# EAGLE design imp2_rev1 (EAGLE 7.7.0)
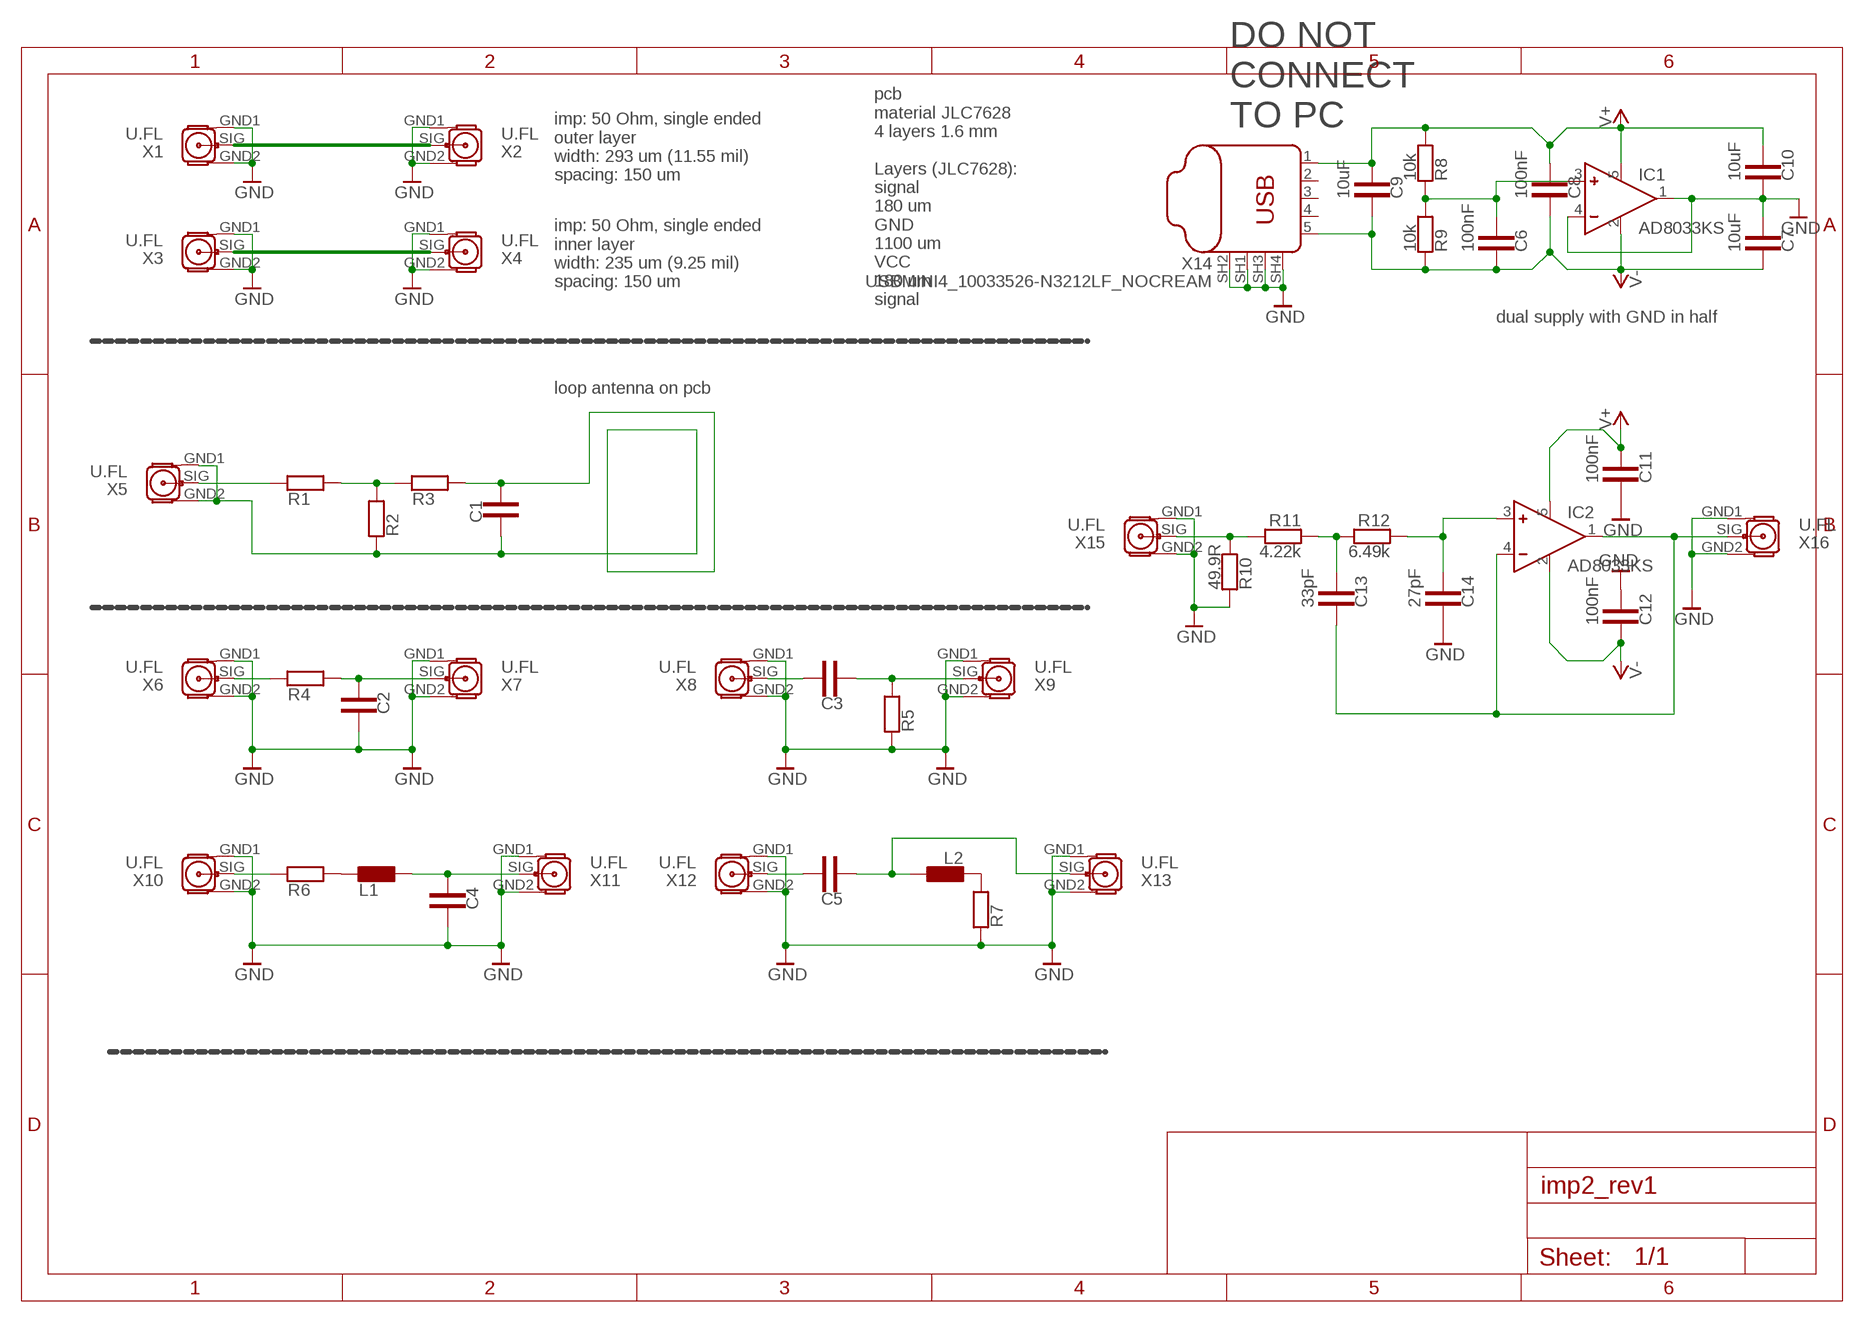
[diagram p0: schematic, sheet 1]

## Parts
C1  C0603  [0603MIL]
C2  C0603  [0603MIL]
C3  C0603  [0603MIL]
C4  C0603  [0603MIL]
C5  C0603  [0603MIL]
C6  100nF  C0603  [0603MIL]
C7  10uF  C0805  [0805MIL]
C8  100nF  C0603  [0603MIL]
C9  10uF  C0805  [0805MIL]
C10  10uF  C0805  [0805MIL]
C11  100nF  C0603  [0603MIL]
C12  100nF  C0603  [0603MIL]
C13  33pF  C0603  [0603MIL]
C14  27pF  C0603  [0603MIL]
IC1  AD8033KS  [SC-705]
IC2  AD8033KS  [SC-705]
L1  L0603  [0603MIL]
L2  L0603  [0603MIL]
R1  R0603  [0603MIL]
R2  R0603  [0603MIL]
R3  R0603  [0603MIL]
R4  R0603  [0603MIL]
R5  R0603  [0603MIL]
R6  R0603  [0603MIL]
R7  R0603  [0603MIL]
R8  10k  R0603  [0603MIL]
R9  10k  R0603  [0603MIL]
R10  49.9R  R0603  [0603MIL]
R11  4.22k  R0603  [0603MIL]
R12  6.49k  R0603  [0603MIL]
X1  U.FL  [U.FL_CONUFL001-SMD]
X2  U.FL  [U.FL_CONUFL001-SMD]
X3  U.FL  [U.FL_CONUFL001-SMD]
X4  U.FL  [U.FL_CONUFL001-SMD]
X5  U.FL  [U.FL_CONUFL001-SMD]
X6  U.FL  [U.FL_CONUFL001-SMD]
X7  U.FL  [U.FL_CONUFL001-SMD]
X8  U.FL  [U.FL_CONUFL001-SMD]
X9  U.FL  [U.FL_CONUFL001-SMD]
X10  U.FL  [U.FL_CONUFL001-SMD]
X11  U.FL  [U.FL_CONUFL001-SMD]
X12  U.FL  [U.FL_CONUFL001-SMD]
X13  U.FL  [U.FL_CONUFL001-SMD]
X14  USBMINI4_10033526-N3212LF_NOCREAM  [USB-MINI_SMD_10033526_NOCREAM]
X15  U.FL  [U.FL_CONUFL001-SMD]
X16  U.FL  [U.FL_CONUFL001-SMD]

## Nets
GND: C2.1 C4.1 C7.2 C10.1 C11.1 C12.2 C14.1 IC1.1(OUT) IC1.4(IN-) R5.1 R7.1 R10.1 X1.GND1 X1.GND2 X2.GND1 X2.GND2 X3.GND1 X3.GND2 X4.GND1 X4.GND2 X6.GND1 X6.GND2 X7.GND1 X7.GND2 X8.GND1 X8.GND2 X9.GND1 X9.GND2 X10.GND1 X10.GND2 X11.GND1 X11.GND2 X12.GND1 X12.GND2 X13.GND1 X13.GND2 X14.SH1(G1) X14.SH2(G2) X14.SH3(G3) X14.SH4(G4) X15.GND1 X15.GND2 X16.GND1 X16.GND2
N$1: R1.1 X5.SIG
N$2: R1.2 R2.2 R3.1
N$3: R4.1 X6.SIG
N$4: C2.2 R4.2 X7.SIG
N$5: C3.1 X8.SIG
N$6: C3.2 R5.2 X9.SIG
N$7: R6.1 X10.SIG
N$8: C4.2 L1.2 X11.SIG
N$9: C5.1 X12.SIG
N$10: L1.1 R6.2
N$11: L2.1 R7.2
N$12: C5.2 L2.2 X13.SIG
N$13: C6.2 IC1.3(IN+) R8.1 R9.2
N$14: C1.1 C1.2 R2.1 R3.2 X5.GND1 X5.GND2
N$15: R10.2 R11.2 X15.SIG
N$16: C13.2 R11.1 R12.2
N$21: C14.2 IC2.3(IN+) R12.1
N$22: C13.1 IC2.1(OUT) IC2.4(IN-) X16.SIG
V+: C8.2 C9.2 C10.2 C11.2 IC1.5(VDD) IC2.5(VDD) R8.2 X14.1(VBUS)
V-: C6.1 C7.1 C8.1 C9.1 C12.1 IC1.2(VSS) IC2.2(VSS) R9.1 X14.5(GND)
W_0.235MM_LAY2: X3.SIG X4.SIG
W_0.293MM_TOP: X1.SIG X2.SIG
Unconnected: X14.2(D-) X14.3(D+) X14.4(ID)

## Notes on the sheet
- DO NOT 
  CONNECT 
  TO PC
- imp: 50 Ohm, single ended
  outer layer
  width: 293 um (11.55 mil)
  spacing: 150 um
- imp: 50 Ohm, single ended
  inner layer
  width: 235 um (9.25 mil)
  spacing: 150 um
- pcb 
  material JLC7628
  4 layers 1.6 mm
  
  Layers (JLC7628):
  signal
  180 um
  GND
  1100 um
  VCC
  180 um
  signal
- dual supply with GND in half
- loop antenna on pcb

## Library data of the parts
C1-C14 = general:C: C Kondensator im Chip-Gehäuse
IC1 IC2 = general:AD8033
L1 L2 = general:L: L Spule im Chip-Gehäuse
R1-R12 = general:R: R Widerstand im Chip-Gehäuse
X1-X13 X15 X16 = general:U.FL
X14 = general:USBMINI4

## Board
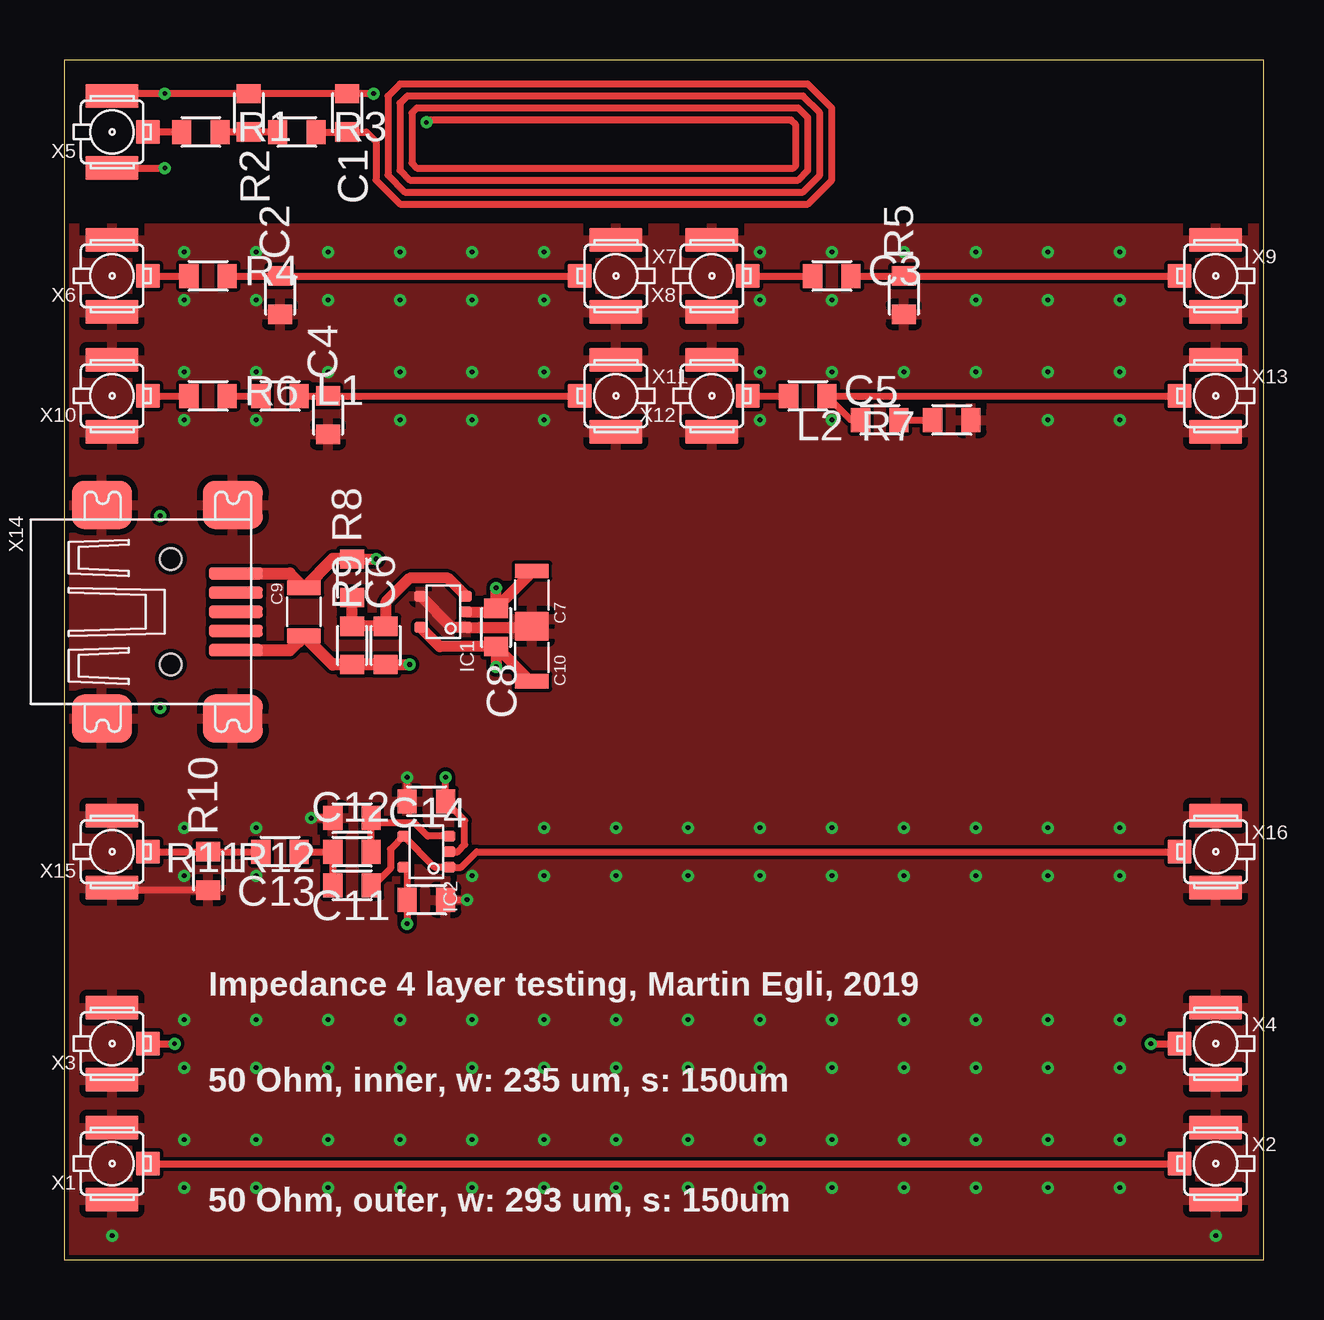
[diagram p1: board, top side]
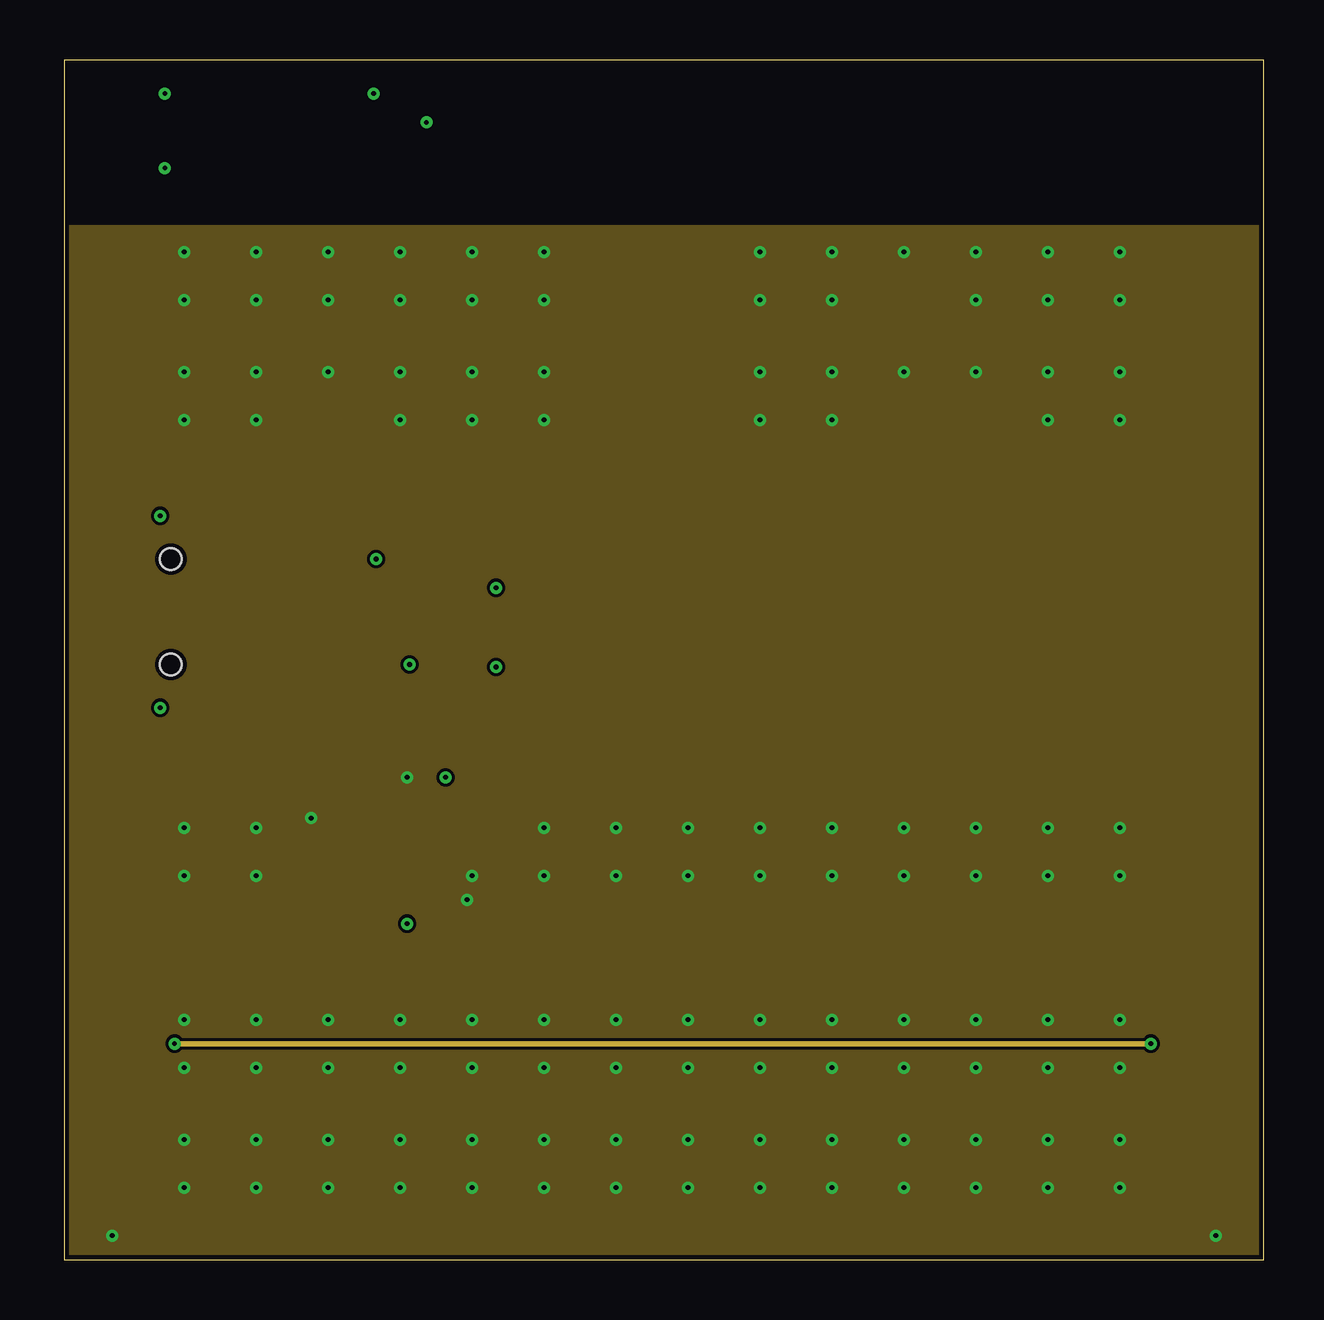
[diagram p2: board, inner layer Route2]
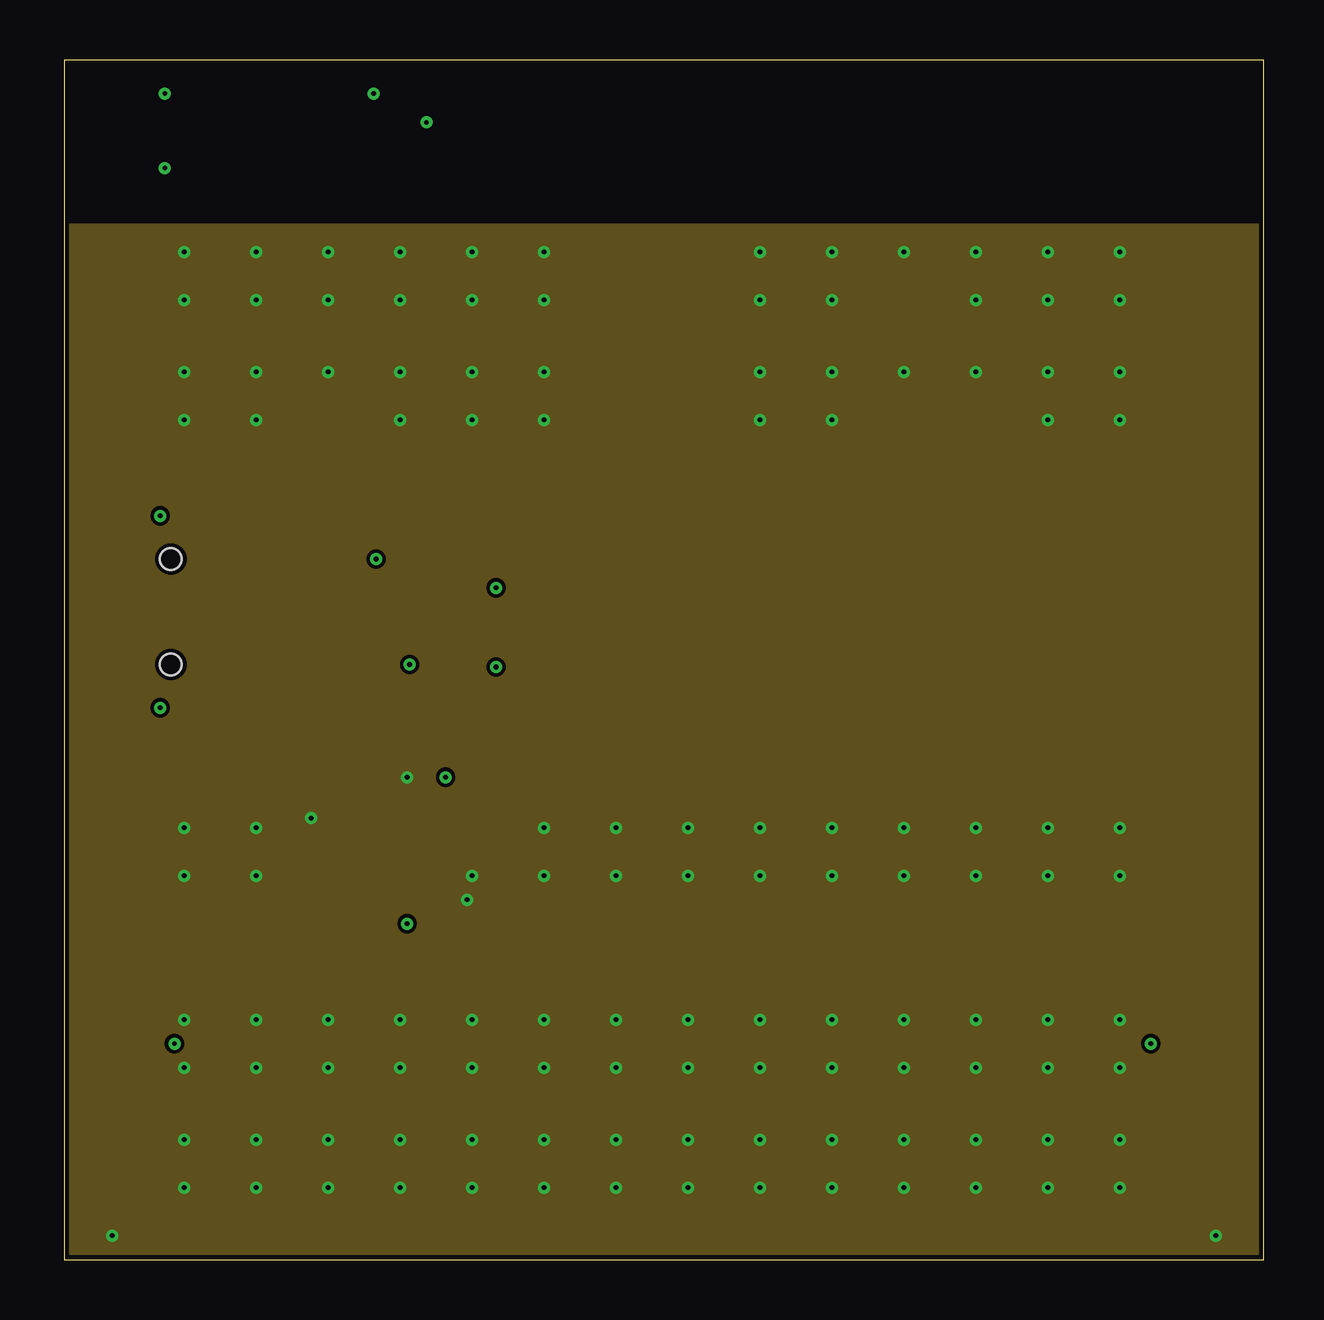
[diagram p3: board, inner layer Route15]
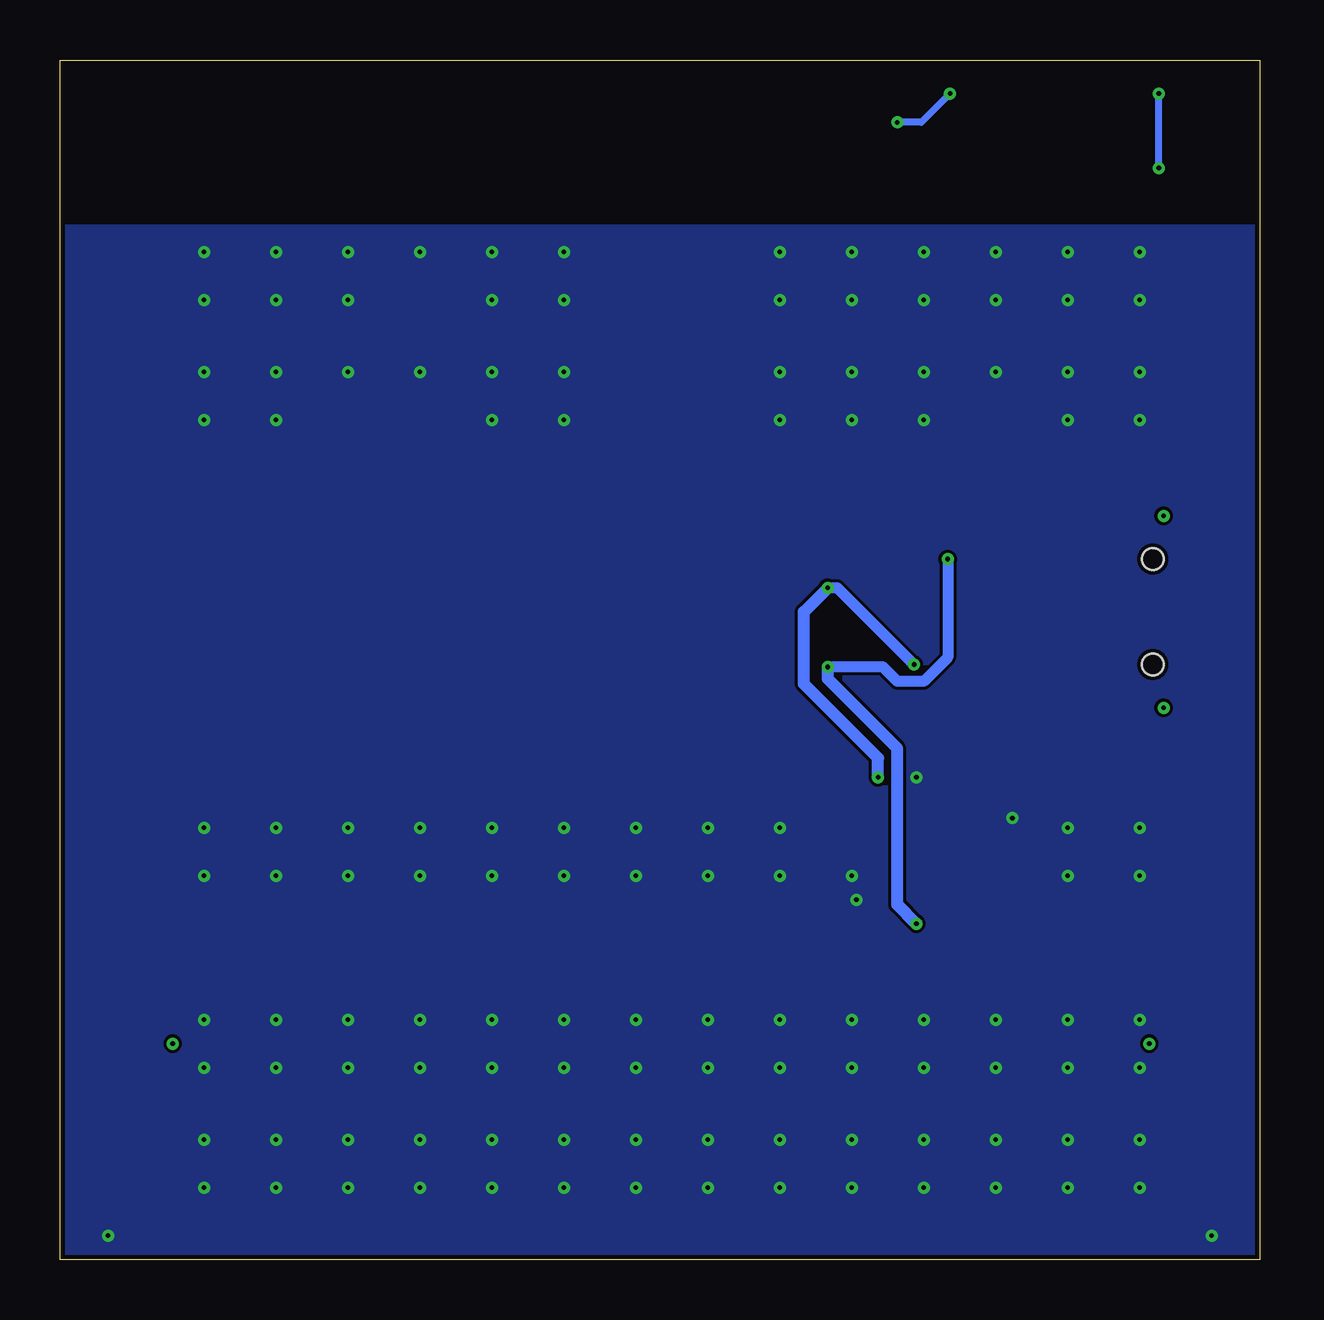
[diagram p4: board, bottom side, seen from below]

Size 50 x 50 mm. Coordinates in mm from the lower left corner, seen from the top.
Outline: 0,0 50,0 50,50 0,50 0,0
Copper layers (1+2*15+16): Top 0.035mm / dielectric 0.18mm / Route2 0.035mm / dielectric 1.1mm / Route15 0.035mm / dielectric 0.18mm / Bottom 0.035mm
Design rules "jlcpcb2layer *": minimum track width 5mil, minimum drill 0.2mm, track to track 5mil, track to pad 5mil, pad to pad 5mil, via to via 5mil, smd to smd 5mil, copper to edge 0.2mm, drill to drill 8mil, minimum pad ring 0.15mm, minimum via ring 0.15mm, stop-mask expansion 4mil, vias tented up to drill 0.2mm, thermal gap 10mil

### Footprints (pad centres in the part's own frame; a part is rotated, then mirrored left to right if it is on the bottom)
0603MIL = smd 0.8 x 1: 1 -0.8,0; 2 0.8,0
0805MIL = smd 0.6 x 1.4: 1 1,0; 2 -1,0
SC-705 = smd 0.5 x 0.45: 1 -0.95,0.65; 2 -0.95,0; 3 -0.95,-0.65; 4 0.95,-0.65; 5 0.95,0.65
U.FL_CONUFL001-SMD = smd 2.2 x 1: GND1 0,-1.5; GND2 0,1.5 | smd 1 x 1: SIG -1.5,0
USB-MINI_SMD_10033526_NOCREAM = smd 0.5 x 2.25: 1 -1.6,3.95; 2 -0.8,3.95; 3 0,3.95; 4 0.8,3.95; 5 1.6,3.95 | smd 2 x 2.5: SH1 -4.45,-1.625; SH2 -4.45,3.825; SH3 4.45,3.825; SH4 4.45,-1.625 | hole 0.9: 2.2,1.25; -2.2,1.25

### Placement (x,y rotation side)
C1  11.8,47.8 270 top
C2  9,40.2 90 top
C3  32,41 0 top
C4  11,35.2 90 top
C5  31,36 0 top
C6  13.4,25.6 90 top
C7  19.5,27.7 90 top
C8  18,26.35 270 top
C9  10,27 270 top
C10  19.5,25.1 90 top
C11  15.1,15 180 top
C12  15.1,19.1 180 top
C13  12,15.6 180 top
C14  12,18.4 0 top
IC1  15.8,27 180 top
IC2  15.1,17 180 top
L1  9,36 0 top
L2  34,35 180 top
R1  5.7,47 0 top
R2  7.7,47.8 270 top
R3  9.7,47 0 top
R4  6,41 0 top
R5  35,40.2 90 top
R6  6,36 0 top
R7  37,35 180 top
R8  12,28.4 90 top
R9  12,25.6 90 top
R10  6,16.2 90 top
R11  9,17 180 top
R12  12,17 180 top
X1  2,4 180 top
X2  48,4 0 top
X3  2,9 180 top
X4  48,9 0 top
X5  2,47 180 top
X6  2,41 180 top
X7  23,41 0 top
X8  27,41 180 top
X9  48,41 0 top
X10  2,36 180 top
X11  23,36 0 top
X12  27,36 180 top
X13  48,36 0 top
X14  3.2,27 270 top
X15  2,17 180 top
X16  48,17 0 top

### Tracks (layer width: path | path; a pad name or v marks a point on that pad's centre or on a via)
GND  (via drill 0.2)
  Top 0.293: X15.GND2 2.1,15.4 R10.1 | C11.1 v16.8,15 | C14.1 v10.3,18.4 | C12.2 v14.3,20.1
  Top 0.45: C7.2 C10.1 19.25,26.35 IC1.1 16.15,26.35 IC1.4
  other vias: 17,3 14,3 11,3 8,3 5,3 2,1 20,3 23,3 26,3 29,3 32,3 35,3 38,3 41,3 44,3 48,1 17,5 14,5 11,5 8,5 5,5 20,5 23,5 26,5 29,5 32,5 35,5 38,5 41,5 44,5 17,10 14,10 11,10 8,10 5,10 20,10 23,10 26,10 29,10 32,10 35,10 38,10 41,10 44,10 17,8 14,8 11,8 8,8 5,8 20,8 23,8 26,8 29,8 32,8 35,8 38,8 41,8 44,8 5,18 8,18 8,16 17,16 20,18 20,16 23,16 23,18 26,16 29,16 32,16 35,16 38,16 41,16 44,16 44,18 41,18 38,18 35,18 32,18 29,18 26,18 20,35 20,37 17,37 14,37 11,37 8,37 5,37 5,35 8,35 17,35 14,35 14,40 14,42 17,42 20,42 20,40 17,40 11,40 11,42 8,42 5,42 5,40 8,40 5,16 44,35 44,37 44,40 44,42 41,42 41,40 38,40 38,42 35,42 32,42 29,42 29,40 32,40 29,37 32,37 35,37 38,37 41,37 41,35 32,35 29,35
  pour Top (isolate 0.15): 50,0 0,0 0,43 50,43
  pour Route2: 50,0 0,0 0,43 50,43
  pour Route15 (isolate 0.15): 50,0 0,0 0,43 50,43
  pour Bottom: 50,0 0,0 0,43 50,43
N$1
  Top 0.3: R1.1 X5.SIG
N$2
  Top 0.3: R3.1 R2.2 R1.2
N$3
  Top 0.293: X6.SIG R4.1
N$4
  Top 0.293: R4.2 C2.2 X7.SIG
N$5
  Top 0.293: X8.SIG C3.1
N$6
  Top 0.293: C3.2 R5.2 X9.SIG
N$7
  Top 0.293: X10.SIG R6.1
N$8
  Top 0.293: L1.2 C4.2 X11.SIG
N$9
  Top 0.293: X12.SIG C5.1
N$10
  Top 0.293: R6.2 L1.1
N$11
  Top 0.293: L2.1 R7.2
N$12
  Top 0.293: X13.SIG C5.2 32.8,35 L2.2
N$13
  Top 0.45: IC1.3 16,28.4 14.4,28.4 13.4,27.4 C6.2 R9.2 R8.1
N$14  (via drill 0.2)
  Top 0.3: v12.9,48.6 C1.1 R2.1 v4.2,48.6 2.1,48.6 X5.GND1 | R3.2 C1.2 12.6,47 13,46.6 13,45 14,44 31,44 32,45 32,48 31,49 14,49 13.5,48.5 13.5,45.2 14.2,44.5 30.8,44.5 31.5,45.2 31.5,47.8 30.8,48.5 14.3,48.5 14,48.2 14,45.4 14.4,45 30.6,45 31,45.4 31,47.6 30.6,48 14.7,48 14.5,47.8 14.5,45.7 14.7,45.5 30.4,45.5 30.5,45.6 30.5,47.3 30.3,47.5 15.2,47.5 v15.1,47.4 | X5.GND2 v4.2,45.5
  Bottom 0.3: v12.9,48.6 14.1,47.4 v15.1,47.4 | v4.2,45.5 v4.2,48.6
N$15
  Top 0.293: X15.SIG R10.2 R11.2
N$16
  Top 0.293: R11.1 R12.2 C13.2
N$21
  Top 0.293: IC2.3 15.15,17.65 14.6,18.2 13,18.2 C14.2 R12.1
N$22
  Top 0.293: X16.SIG 17.2,17 16.55,16.35 IC2.1 15.45,16.35 IC2.4 13.6,17.1 13.6,16.3 12.9,15.6 C13.1
N$23  (via drill 0.2)
  other vias: 4,31
N$24  (via drill 0.2)
  other vias: 4,23
V+  (via drill 0.2)
  Top 0.293: IC2.5 14.3,16.2 C11.2 v14.3,14
  Top 0.45: C8.2 15.65,25.55 IC1.5 | C10.2 19.45,24.1 C8.2 | R8.2 v13,29.2 | C8.2 v18,24.7
  Top 0.5: X14.1 9.4,28.6 C9.2 11.2,29.2 R8.2
  Bottom 0.45: v13,29.2 13,25.1 14,24.1 15.1,24.1 15.7,24.7 v18,24.7
  Bottom 0.5: v14.3,14 15.1,14.8 15.1,21.3 18,24.2 v18,24.7
V-  (via drill 0.2)
  Top 0.293: IC2.2 16.4,17 16.7,17.3 16.7,18.3 C12.1 v15.9,20.1
  Top 0.45: IC1.2 17.85,27 C8.1 | C7.1 19.5,28.65 C8.1 | C6.1 v14.4,24.8 | C8.1 v18,28
  Top 0.5: X14.5 9.4,25.4 C9.1 11.2,24.8 R9.1 C6.1
  Bottom 0.45: v14.4,24.8 17.6,28 v18,28
  Bottom 0.5: v15.9,20.1 15.9,20.9 19,24 19,27 v18,28
W_0.235MM_LAY2  (via drill 0.2)
  Top 0.293: X3.SIG v4.6,9 | v45.3,9 X4.SIG
  Route2 0.235: v4.6,9 v45.3,9
W_0.293MM_TOP
  Top 0.293: X1.SIG X2.SIG

### Text on the board
tPlace: Impedance 4 layer testing, Martin Egli, 2019 | 50 Ohm, inner, w: 235 um, s: 150um | 50 Ohm, outer, w: 293 um, s: 150um